# EAGLE design LED-bas (EAGLE 7.6.0)
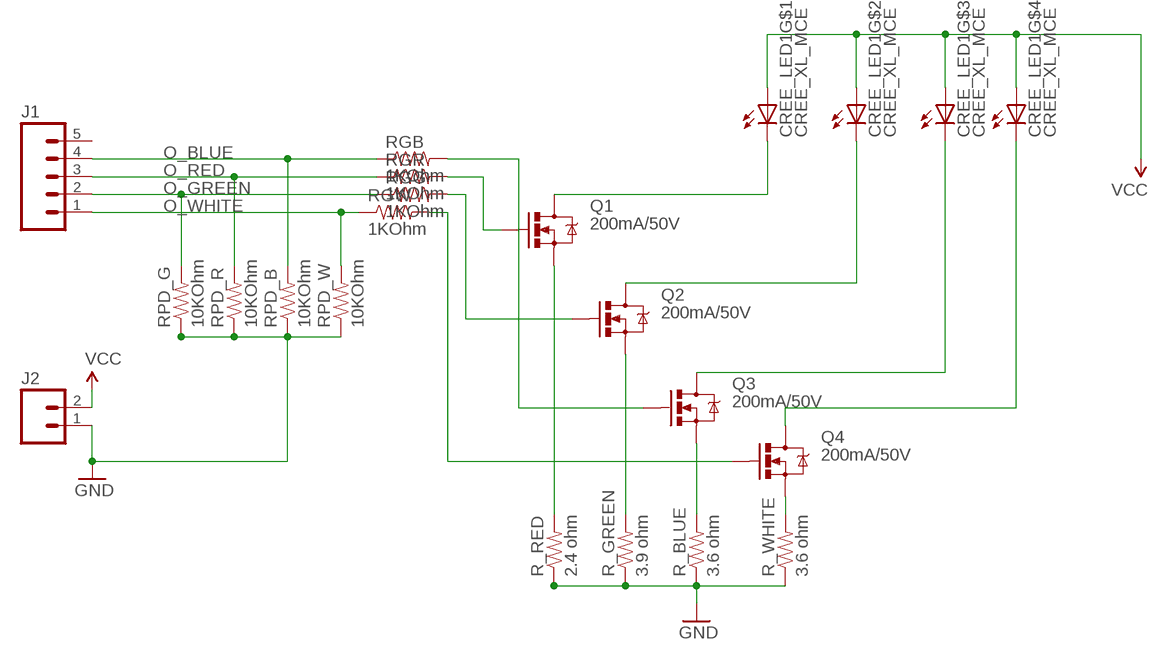
[diagram p0: schematic, sheet 1]

## Parts
CREE_LED1  CREE_XL_MCE  [CREE_XL_MCE]
J1  M05NO_SILK  [1X05_NO_SILK]
J2  M021X02_NO_SILK  [1X02_NO_SILK]
Q1  200mA/50V  MOSFET-NCHANNELBSS138  [SOT23-3]
Q2  200mA/50V  MOSFET-NCHANNELBSS138  [SOT23-3]
Q3  200mA/50V  MOSFET-NCHANNELBSS138  [SOT23-3]
Q4  200mA/50V  MOSFET-NCHANNELBSS138  [SOT23-3]
R_BLUE  3.6 ohm  RESISTOR0805-RES  [0805]
R_GREEN  3.9 ohm  RESISTOR0805-RES  [0805]
R_RED  2.4 ohm  RESISTOR0805-RES  [0805]
R_WHITE  3.6 ohm  RESISTOR0805-RES  [0805]
RGB  1KOhm  RESISTOR0805-RES  [0805]
RGG  1KOhm  RESISTOR0805-RES  [0805]
RGR  1KOhm  RESISTOR0805-RES  [0805]
RGW  1KOhm  RESISTOR0805-RES  [0805]
RPD_B  10KOhm  RESISTOR0805-RES  [0805]
RPD_G  10KOhm  RESISTOR0805-RES  [0805]
RPD_R  10KOhm  RESISTOR0805-RES  [0805]
RPD_W  10KOhm  RESISTOR0805-RES  [0805]

## Nets
GND: J2.1 R_BLUE.1 R_GREEN.1 R_RED.1 R_WHITE.1 RPD_B.1 RPD_G.1 RPD_R.1 RPD_W.1
N$1 [SUPPLY]: Q3.2(S) R_BLUE.2
N$2 [SUPPLY]: Q2.2(S) R_GREEN.2
N$3 [SUPPLY]: Q1.2(S) R_RED.2
N$4: Q2.1(G) RGG.2
N$5: Q1.1(G) RGR.2
N$6: Q3.1(G) RGB.2
N$8: Q4.2(S) R_WHITE.2
N$9 [SUPPLY]: CREE_LED1.6(C) Q3.3(D)
N$10 [SUPPLY]: CREE_LED1.8(C) Q1.3(D)
N$11 [SUPPLY]: CREE_LED1.7(C) Q2.3(D)
N$13: Q4.1(G) RGW.2
N$14 [SUPPLY]: CREE_LED1.5(C) Q4.3(D)
O_BLUE: J1.4 RGB.1 RPD_B.2
O_GREEN: J1.2 RGG.1 RPD_G.2
O_RED: J1.3 RGR.1 RPD_R.2
O_WHITE: J1.1 RGW.1 RPD_W.2
VCC [SUPPLY]: CREE_LED1.1(A) CREE_LED1.2(A) CREE_LED1.3(A) CREE_LED1.4(A) J2.2
Unconnected: CREE_LED1.HT(TH:TH) J1.5

## Library data of the parts
CREE_LED1 = CreeXL-MC-E:CREE_XL_MCE: Cree® LED
J1 = SparkFun-Connectors:M05: Header 5 Standard 5-pin 0.1" header. Use with straight break away headers (SKU : PRT-00116), right angle break away headers (PRT-00553), swiss pins (PRT-00743), machine pins (PRT-00117), and female headers (PRT-00115). Molex polarized connector foot print use with SKU : PRT-08230 with associated crimp pins and housings.
J2 = SparkFun-Connectors:M02: Standard 2-pin 0.1" header. Use with - straight break away headers ( PRT-00116) - right angle break away headers (PRT-00553) - swiss pins (PRT-00743) - machine pins (PRT-00117) - female headers (PRT-00115) Molex polarized connector foot print use with: PRT-08233 with associated crimp pins and housings. 2.54_SCREWTERM for use with PRT-10571. 3.5mm Screw Terminal footprints for PRT-08084 5mm Screw Terminal footprints for use with PRT-08432
Q1-Q4 = SparkFun-DiscreteSemi:MOSFET-NCHANNEL: Common NMOSFET Parts MFG P/N Store ID Prod ID FDD8780 TRANS-09984 SI7820DN TRANS-11055 FDS6630A IC-08089 2N7002PW TRANS-11151 FQP30N06L COM-10213 TRANS-10060 BSS123LT1G TRANS-08345 BSS138 TRANS-00830 BS170 2N7000; PROD_ID: TRANS-00830
R_BLUE R_GREEN R_RED R_WHITE RGB RGG RGR RGW RPD_B RPD_G RPD_R RPD_W = SparkFun-Resistors:RESISTOR: Resistor Basic schematic elements and footprints for 0603, 1206, and PTH resistors.

## Net classes
0 default: width 0.3 mm
1 GND: width 0.5 mm, clearance 0.5 mm
2 SUPPLY: width 0.5 mm, clearance 0.003 mm

## Board
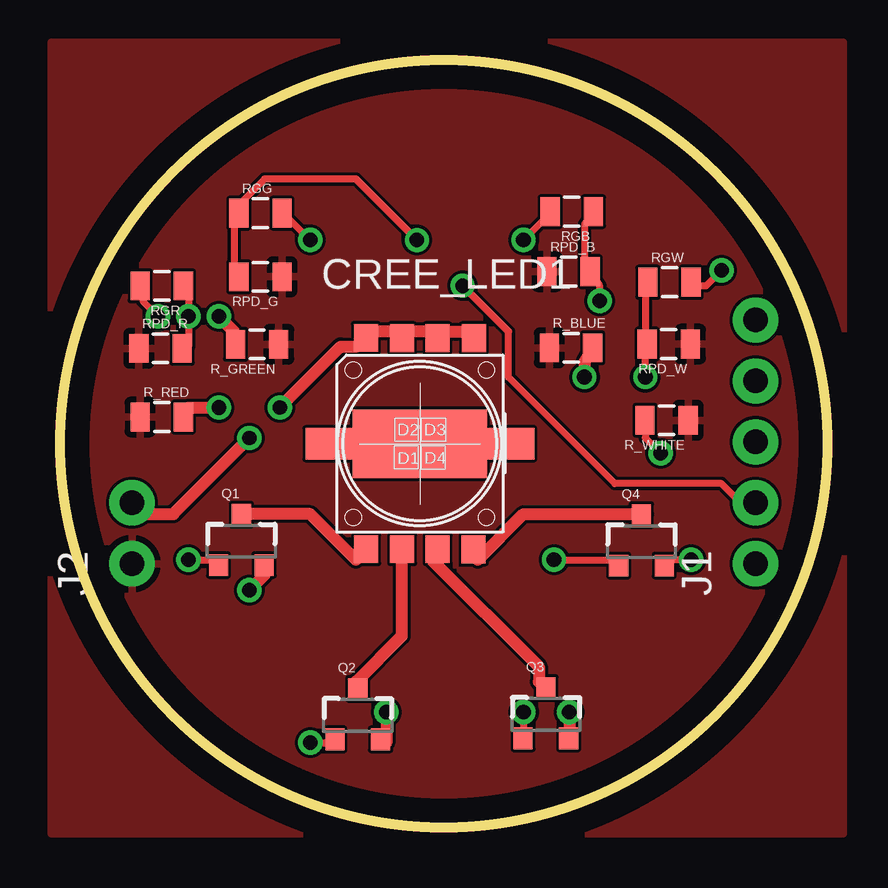
[diagram p1: board, top side]
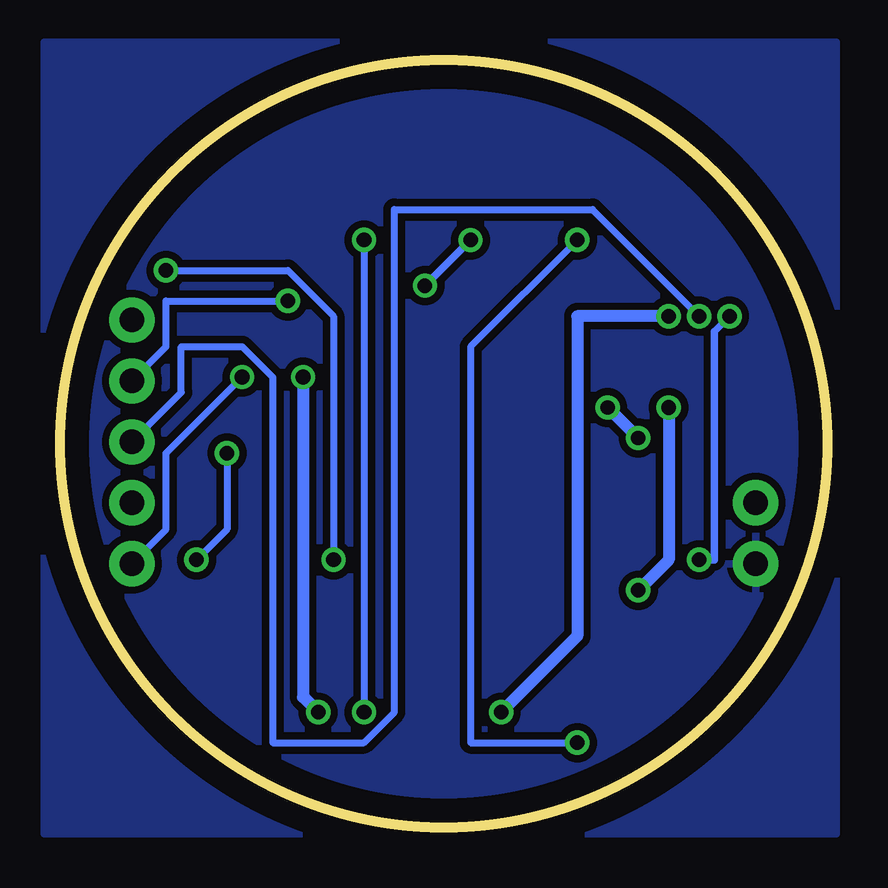
[diagram p2: board, bottom side, seen from below]

Size 32 x 32 mm. Coordinates in mm from the lower left corner, seen from the top.
Outline: circle at 16,16 radius 16
Copper layers (1*16): Top 0.035mm / dielectric 1.5mm / Bottom 0.035mm
Design rules "baballe": minimum track width 5mil, minimum drill 24mil, track to track 4mil, track to pad 4mil, pad to pad 4mil, via to via 4mil, smd to smd 2mil, copper to edge 40mil, drill to drill 8mil, minimum pad ring 10mil, minimum via ring 8mil, stop-mask expansion 4mil, vias tented up to drill 0mil, thermal gap 10mil

### Footprints (pad centres in the part's own frame; a part is rotated, then mirrored left to right if it is on the bottom)
CREE_XL_MCE = smd 1 x 1.16: 1 -2.24,4.42; 2 -0.739,4.408; 3 0.739,4.408; 4 2.256,4.408; 5 2.246,-4.408; 6 0.749,-4.399; 7 -0.739,-4.399; 8 -2.237,-4.399 | smd 5.6 x 2.84: HT 0,0 | smd 2 x 1.3: P$9 3.778,0; P$10 -3.767,0
1X05_NO_SILK = drill 1.016 pad 1.88: 1 0,0; 2 2.54,0; 3 5.08,0; 4 7.62,0; 5 10.16,0
1X02_NO_SILK = drill 1.016 pad 1.88: 1 0,0; 2 2.54,0
SOT23-3 = smd 0.8 x 0.9: 1 -0.95,-1; 2 0.95,-1; 3 0,1.1
0805 = smd 0.8 x 1.2: 1 -0.9,0; 2 0.9,0

### Placement (x,y rotation side)
CREE_LED1  15,16 0 top
J1  29,11 90 top
J2  3,11 90 top
Q1  7.56,11.94 0 top
Q2  12.41,4.68 0 top
Q3  20.26,4.72 0 top
Q4  24.24,11.92 0 top
R_BLUE  21.31,20 0 top
R_GREEN  8.22,20.14 180 top
R_RED  4.24,17.11 0 top
R_WHITE  25.29,16.98 180 top
RGB  21.34,25.68 180 top
RGG  8.35,25.61 0 top
RGR  4.24,22.58 180 top
RGW  25.41,22.73 0 top
RPD_B  21.2,23.18 0 top
RPD_G  8.35,22.96 180 top
RPD_R  4.19,19.98 0 top
RPD_W  25.38,20.16 180 top

### Tracks (layer width: path | path; a pad name or v marks a point on that pad's centre or on a via)
GND
  pour Bottom (isolate 0.305): -0.36,32.75 32.66,32.75 32.66,-0.27 -0.36,-0.27
  pour Top (isolate 0.127): -0.36,32.75 32.66,32.75 32.66,-0.27 -0.36,-0.27
N$1  (via drill 0.61)
  Top 0.5: v21.23,4.81 21.23,3.54 Q3.2 | v21.87,18.78 21.87,19.41 R_BLUE.2
  Bottom 0.5: v21.23,4.81 21.87,5.45 v21.87,18.78
N$2  (via drill 0.61)
  Top 0.5: v13.61,4.81 13.61,3.54 Q2.2 | v6.62,21.32 7.26,20.68 R_GREEN.2
  Bottom 0.5: v13.61,4.81 10.44,7.99 10.44,21.32 v6.62,21.32
N$3  (via drill 0.61)
  Top 0.5: v7.9,9.89 8.53,10.53 Q1.2 | v6.62,17.51 5.35,17.51 R_RED.2
  Bottom 0.5: v7.9,9.89 6.62,11.16 v6.62,17.51
N$4  (via drill 0.61)
  Top 0.3: v10.44,3.54 11.07,3.54 Q2.1 | v10.44,24.5 9.16,25.77 RGG.2
  Bottom 0.3: v10.44,3.54 14.88,3.54 14.88,20.05 v10.44,24.5
N$5  (via drill 0.61)
  Top 0.3: v5.35,11.16 6.62,11.16 Q1.1 | v4.09,21.32 3.45,21.95 3.45,22.59 RGR.2
  Bottom 0.3: v4.09,21.32 4.72,20.68
  Bottom 0.305: 4.72,20.68 4.72,11.16 v5.35,11.16
N$6  (via drill 0.61)
  Top 0.3: v19.33,4.81 19.33,3.54 Q3.1 | v19.33,24.5 20.59,25.77 RGB.2
  Bottom 0.3: v19.33,24.5 v19.33,4.81
N$8  (via drill 0.61)
  Top 0.3: v26.31,11.16 25.04,11.16 Q4.2 | v25.04,15.61 24.41,16.24 24.41,16.88 R_WHITE.2
  Bottom 0.3: v26.31,11.16 25.04,12.43 v25.04,15.61
N$9
  Top 0.5: Q3.3 19.96,6.08 19.96,6.71 15.52,11.16 CREE_LED1.6
N$10
  Top 0.5: Q1.3 7.9,13.06 10.44,13.06 12.34,11.16 CREE_LED1.8
N$11
  Top 0.5: Q2.3 12.34,6.08 14.24,7.99 14.24,11.16 CREE_LED1.7
N$13  (via drill 0.61)
  Top 0.3: v20.59,11.16 23.14,11.16 Q4.1 | v27.58,23.23 26.94,22.59 26.31,22.59 RGW.2
  Bottom 0.3: v20.59,11.16 20.59,21.32 22.5,23.23 v27.58,23.23
N$14
  Top 0.5: Q4.3 24.41,13.06 19.33,13.06 17.42,11.16 CREE_LED1.5
O_BLUE  (via drill 0.61)
  Top 0.3: RGB.1 21.87,25.13 21.87,23.23 RPD_B.2 22.5,22.59 v22.5,21.95
  Bottom 0.3: v22.5,21.95 27.58,21.95 27.58,20.05 28.85,18.78 J1.4
O_GREEN  (via drill 0.6)
  Top 0.3: RPD_G.2 7.26,23.23 7.26,25.13 RGG.1 7.26,25.77 8.53,27.04 12.34,27.04 | 18.69,20.68 18.69,18.78 23.14,14.34 27.58,14.34 28.85,13.06 J1.2
  Top 0.305: 12.34,27.04 v14.88,24.5 | v16.78,22.59 18.69,20.68
  Bottom 0.305: v14.88,24.5 v16.78,22.59
O_RED  (via drill 0.61)
  Top 0.3: RPD_R.2 5.35,20.05 v5.35,21.32 5.35,22.59 RGR.1
  Bottom 0.3: v5.35,21.32 9.8,25.77 18.05,25.77 18.05,4.81 19.33,3.54 23.14,3.54 23.14,18.78 24.41,20.05 26.94,20.05 26.94,18.14 28.85,16.24 J1.3
O_WHITE  (via drill 0.61)
  Top 0.3: RGW.1 24.41,22.59 24.41,20.68 RPD_W.2 24.41,20.05 v24.41,18.78
  Bottom 0.3: v24.41,18.78 27.58,15.61 27.58,12.43 28.85,11.16 J1.1
VCC  (via drill 0.6)
  Top 0.5: 14.24,20.68 15.52,20.68 CREE_LED1.3 16.15,20.68 16.78,20.68 CREE_LED1.4 | 14.24,20.68 12.98,20.68 CREE_LED1.1 12.34,20.05 11.7,20.05 | 14.24,20.68 CREE_LED1.2 | 4.72,13.06 3.45,13.06 J2.2
  Top 0.508: 4.72,13.06 v7.9,16.24 | v9.16,17.51 11.7,20.05
  Bottom 0.508: v7.9,16.24 v9.16,17.51